# EasyEDA Pro project CogletESP_2026-02-24.epro, schematic Grove - Vision AI Module V2
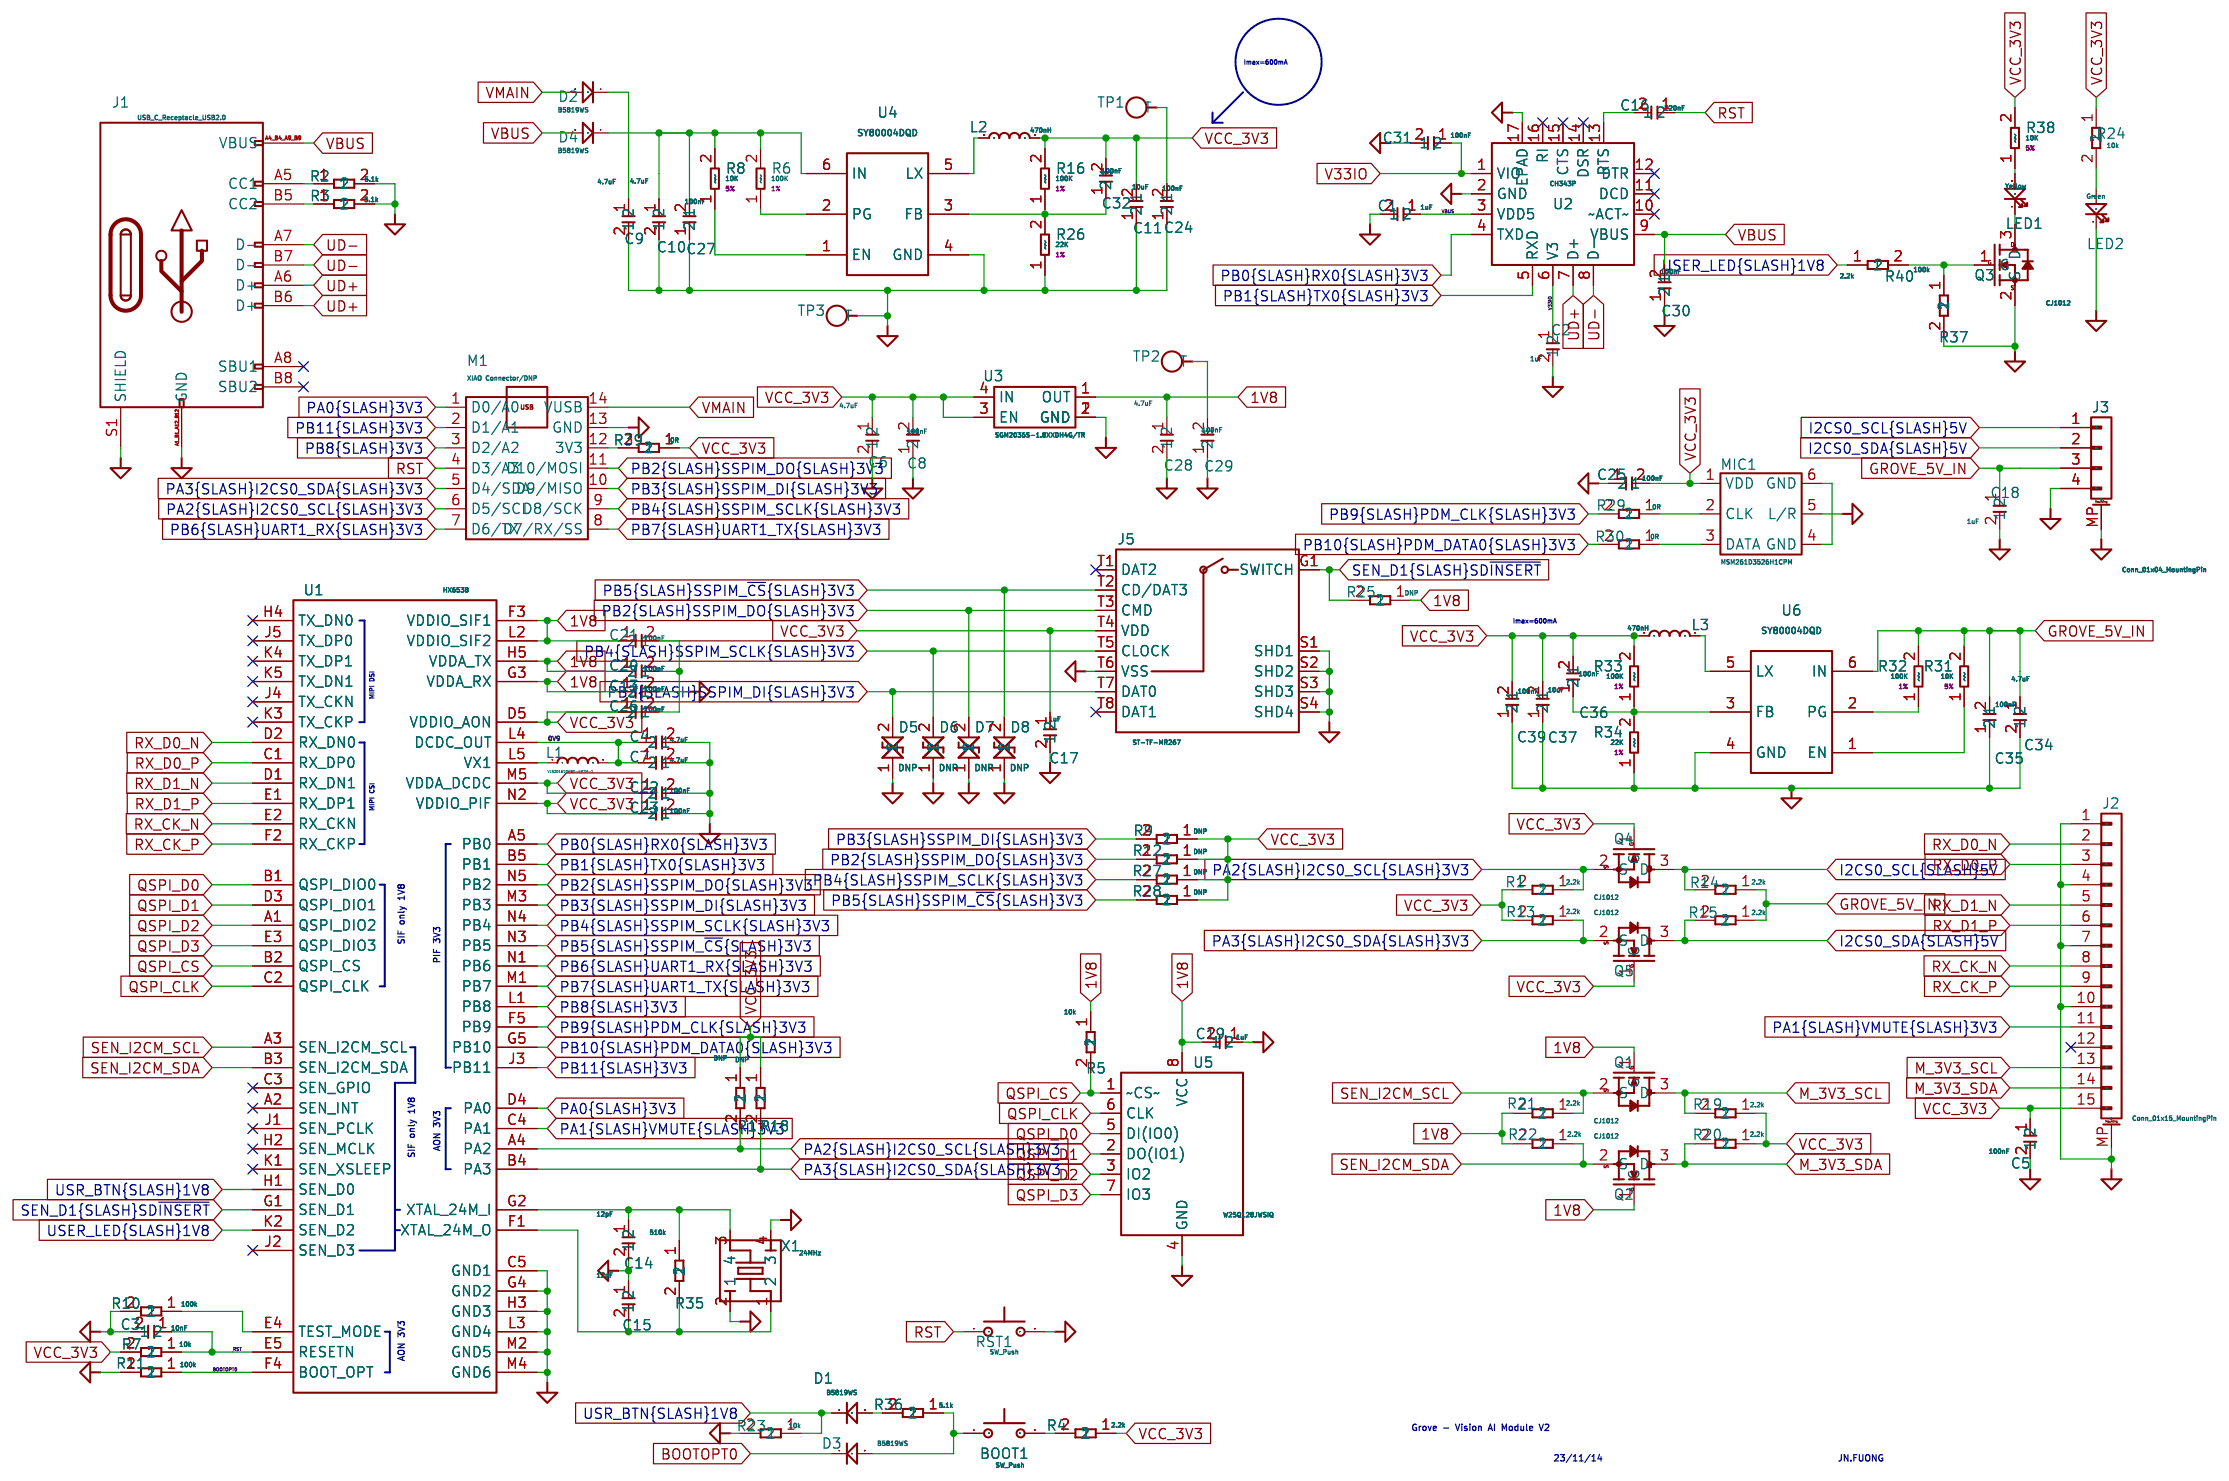
[diagram p0: schematic sheet]

## Parts
BOOT1  SW_Push  [MLCCs:SW_Push_1P1T_NO_Vertical_Wuerth_434133025816]
C1  1uF  [MLCCs:C0402]
C2  1uF  [MLCCs:C0402]
C3  10nF  [MLCCs:C0402]
C4  4.7uF  [MLCCs:C0402]
C5  100nF  [MLCCs:C0402]
C6  4.7uF  [MLCCs:C0402]
C7  4.7uF  [MLCCs:C0402]
C8  100nF  [MLCCs:C0402]
C9  4.7uF  [MLCCs:C0402]
C10  4.7uF  [MLCCs:C0402]
C11  10uF  [MLCCs:C0402]
C13  100nF  [MLCCs:C0402]
C14  12pF  [MLCCs:C0402]
C15  12pF  [MLCCs:C0402]
C16  220nF  [MLCCs:C0402]
C17  1uF  [MLCCs:C0402]
C18  1uF  [MLCCs:C0402]
C19  1uF  [MLCCs:C0402]
C20  100nF  [MLCCs:C0402]
C21  100nF  [MLCCs:C0402]
C22  100nF  [MLCCs:C0402]
C23  100nF  [MLCCs:C0402]
C24  100nF  [MLCCs:C0402]
C25  100nF  [MLCCs:C0402]
C26  100nF  [MLCCs:C0402]
C27  100nF  [MLCCs:C0402]
C28  4.7uF  [MLCCs:C0402]
C29  100nF  [MLCCs:C0402]
C30  100nF  [MLCCs:C0402]
C31  100nF  [MLCCs:C0402]
C32  100nF  [MLCCs:C0402]
C34  4.7uF  [MLCCs:C0402]
C35  100nF  [MLCCs:C0402]
C36  100nF  [MLCCs:C0402]
C37  10uF  [MLCCs:C0402]
C39  100nF  [MLCCs:C0402]
D1  B5819WS  [MLCCs:D0805_SOD323]
D2  B5819WS  [MLCCs:D0805_SOD323]
D3  B5819WS  [MLCCs:D0805_SOD323]
D4  B5819WS  [MLCCs:D0805_SOD323]
D5  DNP  [MLCCs:R0402]
D6  DNP  [MLCCs:R0402]
D7  DNP  [MLCCs:R0402]
D8  DNP  [MLCCs:R0402]
J1  USB_C_Receptacle_USB2.0  [MLCCs:USB2.0-TYPE-C]
J2  Conn_01x15_MountingPin  [MLCCs:FPC_DNC_15P_1.0mm]
J3  Conn_01x04_MountingPin  [MLCCs:4P-SMD-2.0mm-RIGHT]
J5  ST-TF-MR267  [Connector:SD-TF-MR267]
L1  VLS201610HBX-4R7M-1  [MLCCs:L0806]
L2  470nH  [MLCCs:L0603]
L3  470nH  [MLCCs:L0603]
LED1  Yellow  [MLCCs:LED0402]
LED2  Green  [MLCCs:LED0402]
M1  XIAO Connector/DNP  [MLCCs:XIAO_Socket]
MIC1  MSM261D3526H1CPM  [MLCCs:MIC6P-3.5X2.65X0.94MM]
Q1  CJ1012  [MLCCs:SOT523]
Q2  CJ1012  [MLCCs:SOT523]
Q3  CJ1012  [MLCCs:SOT523]
Q4  CJ1012  [MLCCs:SOT523]
Q5  CJ1012  [MLCCs:SOT523]
R1  2.2k  [MLCCs:R0402]
R2  5.1k  [MLCCs:R0402]
R3  5.1k  [MLCCs:R0402]
R4  2.2k  [MLCCs:R0402]
R5  10k  [MLCCs:R0402]
R6  100K  [MLCCs:R0402]
R7  10k  [MLCCs:R0402]
R8  10K  [MLCCs:R0402]
R9  DNP  [MLCCs:R0402]
R10  100k  [MLCCs:R0402]
R11  100k  [MLCCs:R0402]
R12  DNP  [MLCCs:R0402]
R13  2.2k  [MLCCs:R0402]
R14  2.2k  [MLCCs:R0402]
R15  2.2k  [MLCCs:R0402]
R16  100K  [MLCCs:R0402]
R17  DNP  [MLCCs:R0402]
R18  DNP  [MLCCs:R0402]
R19  2.2k  [MLCCs:R0402]
R20  2.2k  [MLCCs:R0402]
R21  2.2k  [MLCCs:R0402]
R22  2.2k  [MLCCs:R0402]
R23  10k  [MLCCs:R0402]
R24  10k  [MLCCs:R0402]
R25  DNP  [MLCCs:R0402]
R26  22K  [MLCCs:R0402]
R27  DNP  [MLCCs:R0402]
R28  DNP  [MLCCs:R0402]
R29  0R  [MLCCs:R0402]
R30  0R  [MLCCs:R0402]
R31  10K  [MLCCs:R0402]
R32  100K  [MLCCs:R0402]
R33  100K  [MLCCs:R0402]
R34  22K  [MLCCs:R0402]
R35  510k  [MLCCs:R0402]
R36  5.1k  [MLCCs:R0402]
R37  100k  [MLCCs:R0402]
R38  10K  [MLCCs:R0402]
R39  0R  [MLCCs:R0402]
R40  2.2k  [MLCCs:R0402]
RST1  SW_Push  [MLCCs:SW_Push_1P1T_NO_Vertical_Wuerth_434133025816]
TP1  Test Point  [Misc:TP-D35MIL]
TP2  Test Point  [Misc:TP-D35MIL]
TP3  Test Point  [Misc:TP-D35MIL]
U1  HX6538  [MLCCs:WLCSP65_5.6x2.3x0.56mm]
U2  CH343P  [MLCCs:QFN-16-EP_3x3mm_P0.5mm_EP1x1mm]
U3  SGM2036S-1.8XXDH4G/TR  [MLCCs:X2SON-4]
U4  SY80004DQD  [Ic:DFN6-0.5-1.5X1.5X0.65MM]
U5  W25Q128JWSIQ  [MLCCs:SOIC-8_5.23x5.23mm_P1.27mm]
U6  SY80004DQD  [Ic:DFN6-0.5-1.5X1.5X0.65MM]
X1  24MHz  [MLCCs:4P2016]

## Library data of the parts
BOOT1 RST1 = Switch_SW_Push
C1-C11 C13-C32 C34-C37 C39 = Discreted_C
D1-D4 = Discreted_D: Sim_Device: D; Sim_Pins: 1=K 2=A; Sim.Device: D; Sim.Pins: 1=K 2=A
D5-D8 = Seeed_libdb_Diode/DOUBLE-ESD-2P: MPN: DF2S6.8FS; SKU: DOUBLE-ESD-2P; Part Type: ESD
J1 = AMzConnectors_USB_C_Receptacle_USB2.0
J2 = Connector_Generic_MountingPin_Conn_01x15_MountingPin
J3 = Connector_Generic_MountingPin_Conn_01x04_MountingPin
J5 = Seeed_libdb_Connector/MicroSD-Card-9+4P: MPN: SD-TF-MR267; Manufacturer: 商祺电子; SKU: MicroSD-Card-9+4P
L1 = Discreted_L: User doc link: https://atta.szlcsc.com/upload/public/pdf/source/20210916/5D33DED32780FEB7D0AA8BED8FC93477.pdf
L2 L3 = Discreted_L
LED1 LED2 = Discreted_LED
M1 = SoMs_XIAO
MIC1 = Intergrated_Chips_MIC-MSM261D3526H1CPM
Q1-Q5 = Discreted_NMOS
R1-R5 R7 R9-R15 R17-R25 R27-R30 R35-R37 R39 R40 = Discreted_R: MPN: DF2S6.8FS; Part Type: ESD; SKU: DOUBLE-ESD-2P
R6 R16 R26 R32-R34 = Seeed_libdb_Resistors/301010010: Manufacturer: YAGEO; MPN: RC0402JR-074K7L; SKU: 301010010; Resistance: 4.7K; Part Type: RES; Power Rating: 1%; Status: BeagleBone Carrier Board; Temperature: -55°C to 155°C
R8 R31 R38 = Seeed_libdb_Resistors/301010010: Manufacturer: YAGEO; MPN: RC0402JR-074K7L; SKU: 301010010; Resistance: 4.7K; Part Type: RES; Power Rating: 5%; Status: BeagleBone Carrier Board; Temperature: -55°C to 155°C
TP1-TP3 = Seeed_libdb_Misc/TP35C_SMD: SKU: TP35C_SMD
U1 = Intergrated Chips_HX6538-A-WLCSP65
U2 = Intergrated Chips_CH343p
U3 = Intergrated_Chips_TLV733P
U4 = Seeed_libdb_Ic/SY80004DQD: Attribute1: U6; Manufacturer: SILERGY; Part Type: DCDC; Temperature: -40°C to 85°C
U5 = Memory_Flash_W25Q32JVSS: User doc link: https://atta.szlcsc.com/upload/public/pdf/source/20210420/C2595075_E7A7725B7CF2DE50C07916BF10CAF3A1.pdf
U6 = Seeed_libdb_Ic/SY80004DQD: Manufacturer: SILERGY; Part Type: DCDC; Temperature: -40°C to 85°C
X1 = Discreted_CRYSTAL-4P

## Nets
0V9: C4.1 C7.1 L1.2 U1.L4(DCDC_OUT)
1V8: C13.1 C19.2 C20.1 C21.1 C28.1 C29.2 Q1.1(G) Q2.1(G) R5.1 R21.2 R22.2 R25.1 TP2.1(T) U1.F3(VDDIO_SIF1) U1.G3(VDDA_RX) U1.H5(VDDA_TX) U1.L2(VDDIO_SIF2) U3.1(OUT) U5.8(VCC)
V33IO: C2.1 C31.1 U2.1(VIO) U2.6(V3)
VBUS: C1.1 C30.2 D4.2(A) J1.A4_B4_A9_B9(VBUS) U2.3(VDD5) U2.9(VBUS)
VCC_3V3: C5.1 C6.1 C8.2 C11.2 C17.1 C22.1 C23.1 C24.2 C25.2 C26.1 C32.2 C36.2 C37.2 C39.2 J2.15(Pin) J5.T4(VDD) L2.2 L3.2 MIC1.1(VDD) Q4.1(G) Q5.1(G) R1.2 R4.1 R7.2 R9.1 R12.1 R13.2 R16.2 R17.1 R18.1 R19.1 R20.1 R24.1 R27.1 R28.1 R33.2 R38.2 R39.1 TP1.1(T) U1.D5(VDDIO_AON) U1.M5(VDDA_DCDC) U1.N2(VDDIO_PIF) U3.3(EN) U3.4(IN)
BOOTOPT0: D3.1(K) R11.1 U1.F4(BOOT_OPT)
GROVE_5V_IN: C18.1 C34.1 C35.2 J3.3(Pin) R14.1 R15.1 R31.2 R32.2 U6.6(IN)
I2CS0_SCL{SLASH}5V: J3.1(Pin) Q4.3(D) R14.2
I2CS0_SDA{SLASH}5V: J3.2(Pin) Q5.3(D) R15.2
M_3V3_SCL: J2.13(Pin) Q1.3(D) R19.2
M_3V3_SDA: J2.14(Pin) Q2.3(D) R20.2
PA0{SLASH}3V3: M1.1(D0/A0) U1.D4(PA0)
PA1{SLASH}VMUTE{SLASH}3V3: J2.11(Pin) U1.C4(PA1)
PA2{SLASH}I2CS0_SCL{SLASH}3V3: M1.6(D5/SCL) Q4.2(S) R1.1 R17.2 U1.A4(PA2)
PA3{SLASH}I2CS0_SDA{SLASH}3V3: M1.5(D4/SDA) Q5.2(S) R13.1 R18.2 U1.B4(PA3)
PB0{SLASH}RX0{SLASH}3V3: U1.A5(PB0) U2.4(TXD)
PB1{SLASH}TX0{SLASH}3V3: U1.B5(PB1) U2.5(RXD)
PB2{SLASH}SSPIM_DO{SLASH}3V3: D7.2 J5.T3(CMD) M1.11(D10/MOSI) R12.2 U1.N5(PB2)
PB3{SLASH}SSPIM_DI{SLASH}3V3: D5.2 J5.T7(DAT0) M1.10(D9/MISO) R9.2 U1.M3(PB3)
PB4{SLASH}SSPIM_SCLK{SLASH}3V3: D6.2 J5.T5(CLOCK) M1.9(D8/SCK) R27.2 U1.N4(PB4)
PB5{SLASH}SSPIM_~{CS}{SLASH}3V3: D8.2 J5.T2(CD/DAT3) R28.2 U1.N3(PB5)
PB6{SLASH}UART1_RX{SLASH}3V3: M1.7(D6/TX) U1.N1(PB6)
PB7{SLASH}UART1_TX{SLASH}3V3: M1.8(D7/RX/SS) U1.M1(PB7)
PB8{SLASH}3V3: M1.3(D2/A2) U1.L1(PB8)
PB9{SLASH}PDM_CLK{SLASH}3V3: R29.2 U1.F5(PB9)
PB10{SLASH}PDM_DATA0{SLASH}3V3: R30.2 U1.G5(PB10)
PB11{SLASH}3V3: M1.2(D1/A1) U1.J3(PB11)
POWER_GND: C1.2 C2.2 C3.2 C4.2 C5.2 C6.2 C7.2 C8.1 C9.2 C10.2 C11.1 C13.2 C14.2 C15.1 C17.2 C18.2 C19.1 C20.2 C21.2 C22.2 C23.2 C24.1 C25.1 C26.2 C27.1 C28.2 C29.1 C30.1 C31.2 C34.2 C35.1 C37.1 C39.1 D5.1 D6.1 D7.1 D8.1 J1.A1_B1_A12_B12(GND) J1.S1(SHIELD) J2.1(Pin) J2.4(Pin) J2.7(Pin) J2.10(Pin) J2.MP(MountPin) J3.4(Pin) J3.MP(MountPin) J5.S1(SHD1) J5.S2(SHD2) J5.S3(SHD3) J5.S4(SHD4) J5.T6(VSS) LED2.1(K) M1.13(GND) MIC1.4(GND) MIC1.5(L/R) MIC1.6(GND) Q3.2(S) R2.2 R3.2 R10.2 R11.2 R23.2 R26.1 R34.1 R37.2 RST1.2 TP3.1(T) U1.C5(GND1) U1.G4(GND2) U1.H3(GND3) U1.L3(GND4) U1.M2(GND5) U1.M4(GND6) U2.2(GND) U2.17(EPAD) U3.2(GND) U3.T(GND) U4.4(GND) U5.4(GND) U6.4(GND) X1.2(1) X1.4(3)
QSPI_CLK: U1.C2(QSPI_CLK) U5.6(CLK)
QSPI_CS: R5.2 U1.B2(QSPI_CS) U5.1(~CS~)
QSPI_D0: U1.B1(QSPI_DIO0) U5.5(DI(IO0))
QSPI_D1: U1.D3(QSPI_DIO1) U5.2(DO(IO1))
QSPI_D2: U1.A1(QSPI_DIO2) U5.3(IO2)
QSPI_D3: U1.E3(QSPI_DIO3) U5.7(IO3)
RST: C3.1 C16.1 M1.4(D3/A3) R7.1 RST1.1 U1.E5(RESETN)
RX_CK_N: J2.8(Pin) U1.E2(RX_CKN)
RX_CK_P: J2.9(Pin) U1.F2(RX_CKP)
RX_D0_N: J2.2(Pin) U1.D2(RX_DN0)
RX_D0_P: J2.3(Pin) U1.C1(RX_DP0)
RX_D1_N: J2.5(Pin) U1.D1(RX_DN1)
RX_D1_P: J2.6(Pin) U1.E1(RX_DP1)
SEN_D1{SLASH}SD~{INSERT}: J5.G1(SWITCH) R25.2 U1.G1(SEN_D1)
SEN_I2CM_SCL: Q1.2(S) R21.1 U1.A3(SEN_I2CM_SCL)
SEN_I2CM_SDA: Q2.2(S) R22.1 U1.B3(SEN_I2CM_SDA)
UD+: J1.A6(D+) J1.B6(D+) U2.7(D+)
UD-: J1.A7(D-) J1.B7(D-) U2.8(D-)
USER_LED{SLASH}1V8: R40.1 U1.K2(SEN_D2)
USR_BTN{SLASH}1V8: D1.1(K) R23.1 U1.H1(SEN_D0)
VMAIN: D2.2(A) M1.14(VUSB)
NET-(BOOT1-PAD2): BOOT1.2 R4.2
NET-(D1-A): D1.2(A) R36.2
NET-(D2-K): C9.1 C10.1 C27.2 D2.1(K) D4.1(K) R6.2 R8.2 U4.6(IN)
NET-(D3-A): BOOT1.1 D3.2(A) R36.1
NET-(J1-CC1): J1.A5(CC1) R2.1
NET-(J1-CC2): J1.B5(CC2) R3.1
NET-(LED1-A): LED1.2(A) R38.1
NET-(LED1-K): LED1.1(K) Q3.3(D)
NET-(LED2-A): LED2.2(A) R24.2
NET-(M1-3V3): M1.12(3V3) R39.2
NET-(MIC1-CLK): MIC1.2(CLK) R29.1
NET-(MIC1-DATA): MIC1.3(DATA) R30.1
NET-(Q3-G): Q3.1(G) R37.1 R40.2
NET-(U1-TEST_MODE): R10.1 U1.E4(TEST_MODE)
NET-(U1-VX1): L1.1 U1.L5(VX1)
NET-(U1-XTAL_24M_I): C14.1 R35.1 U1.G2(XTAL_24M_I) X1.3(4)
NET-(U1-XTAL_24M_O): C15.2 R35.2 U1.F1(XTAL_24M_O) X1.1(2)
NET-(U2-RTS): C16.2 U2.13(RTS)
NET-(U4-EN): R8.1 U4.1(EN)
NET-(U4-FB): C32.1 R16.1 R26.2 U4.3(FB)
NET-(U4-LX): L2.1 U4.5(LX)
NET-(U4-PG): R6.1 U4.2(PG)
NET-(U6-EN): R31.1 U6.1(EN)
NET-(U6-FB): C36.1 R33.1 R34.2 U6.3(FB)
NET-(U6-LX): L3.1 U6.5(LX)
NET-(U6-PG): R32.1 U6.2(PG)

Not connected (* = marked no-connect by the designer): J1 A8(SBU1)* B8(SBU2)*; J2 12(Pin)*; J5 T1(DAT2)* T8(DAT1)*; U1 A2(SEN_INT)* C3(SEN_GPIO)* H2(SEN_MCLK)* H4(TX_DN0)* J1(SEN_PCLK)* J2(SEN_D3)* J4(TX_CKN)* J5(TX_DP0)* K1(SEN_XSLEEP)* K3(TX_CKP)* K4(TX_DP1)* K5(TX_DN1)*; U2 10(~ACT~)* 11(DCD)* 12(DTR)* 14(DSR)* 15(CTS)* 16(RI)*

## Notes on the sheet
- Imax=600mA
- Imax=600mA
- MIPI DSI
- MIPI CSI
- SIF only 1V8
- PIF 3V3
- SIF only 1V8
- AON 3V3
- AON 3V3
- Grove - Vision AI Module V2
- 23/11/14
- JN.FUONG
